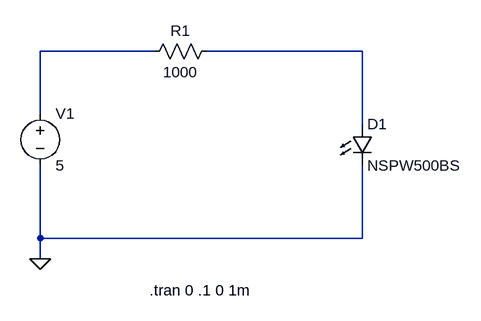
[diagram p0: schematic led.asc]
led.asc, the LTspice schematic file:
Version 4
SHEET 1 880 680
WIRE 48 112 -128 112
WIRE 368 112 128 112
WIRE -128 208 -128 112
WIRE 368 224 368 112
WIRE -128 400 -128 288
WIRE 368 400 368 288
WIRE 368 400 -128 400
WIRE -128 432 -128 400
FLAG -128 432 0
SYMBOL LED 352 224 R0
SYMATTR InstName D1
SYMATTR Value NSPW500BS
SYMBOL res 144 96 R90
WINDOW 0 0 56 VBottom 2
WINDOW 3 32 56 VTop 2
SYMATTR InstName R1
SYMATTR Value 1000
SYMBOL voltage -128 192 R0
SYMATTR InstName V1
SYMATTR Value 5
TEXT 40 480 Left 2 !.tran 0 .1 0 1m

The netlist it stands for:
* led.asc
D1 N002 0 NSPW500BS
R1 N002 N001 1000
V1 N001 0 5
.model D D
.lib standard.dio
.tran 0 .1 0 1m
.backanno
.end